# Altium schematic sheet LedMatrix_Top.SchDoc
size A4; Organization: Altium Limited; Address1: L3, 12a Rodborough Rd; Address2: Frenchs Forest; Address3: NSW; Address4: Australia 2086; DocumentNumber: 1; SheetNumber: 1; SheetTotal: 6
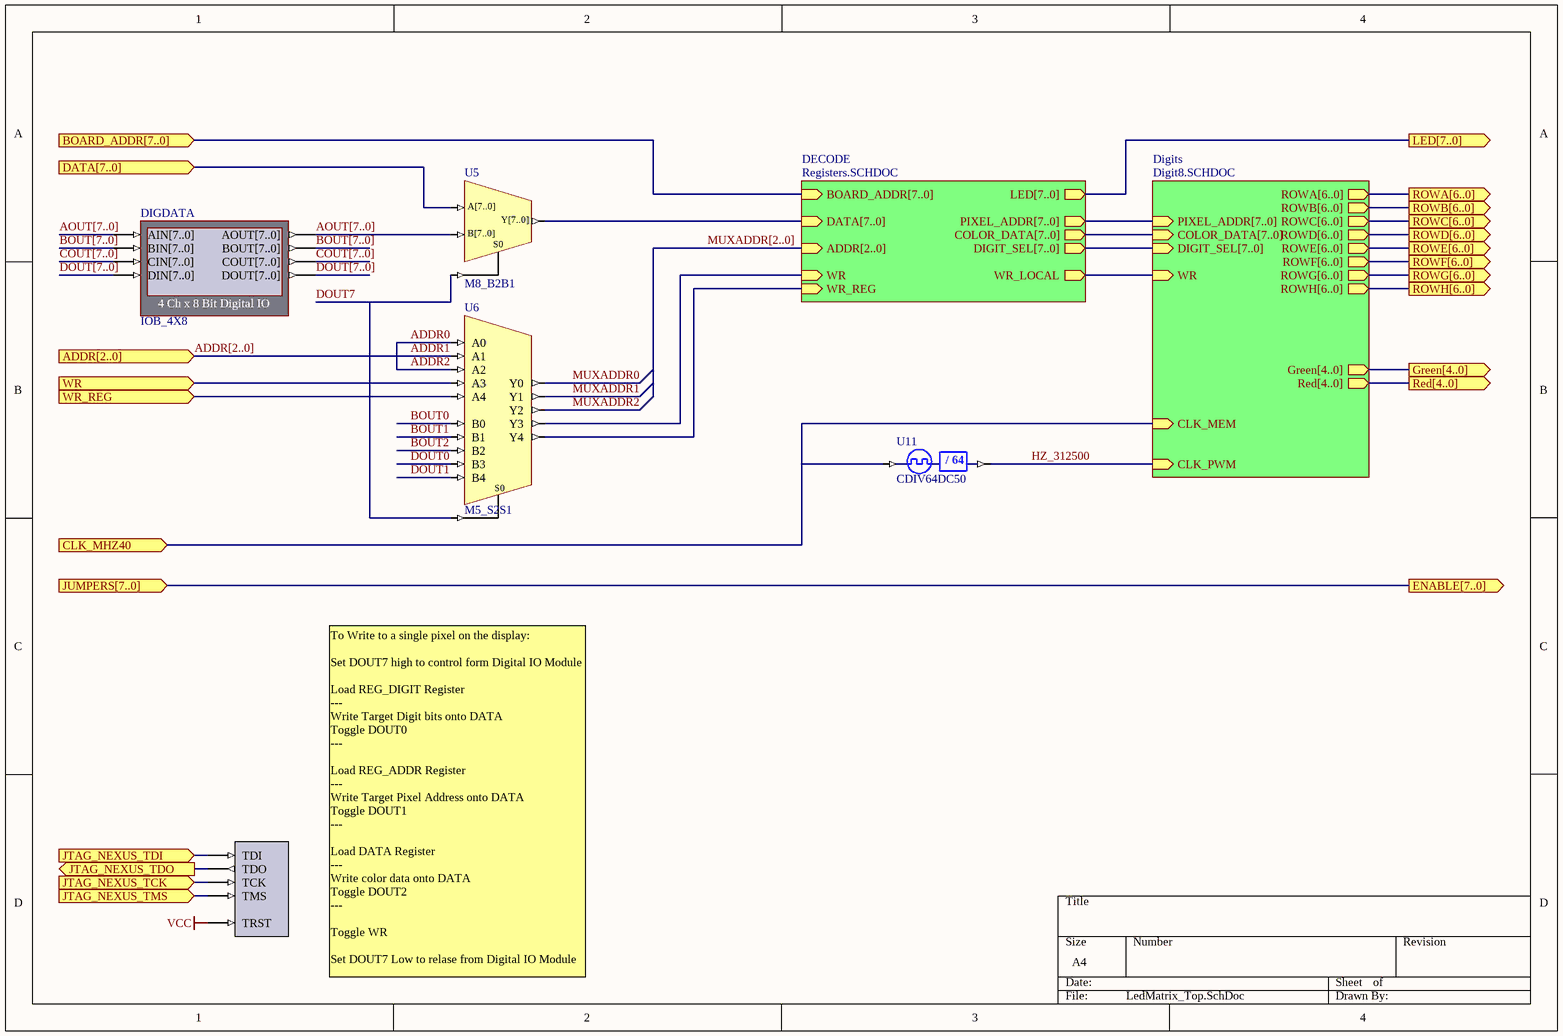
[diagram p0: LedMatrix_Top.SchDoc]

## Parts
DIGDATA  IOB_4X8
NEXUS_JTAG_PORT1  NEXUS_JTAG_PORT  (value not drawn)
U5  M8_B2B1
U6  M5_S2S1
U11  CDIV64DC50

## Sub-sheets
DECODE = Registers.SCHDOC: WR (in), ADDR[2..0] (in), BOARD_ADDR[7..0] (in), PIXEL_ADDR[7..0] (out), DATA[7..0] (in), COLOR_DATA[7..0] (out), DIGIT_SEL[7..0] (out), WR_LOCAL (out), LED[7..0] (out), WR_REG (in)
Digits = Digit8.SCHDOC: ROWB[6..0] (out), ROWC[6..0] (out), ROWD[6..0] (out), ROWF[6..0] (out), ROWG[6..0] (out), ROWH[6..0] (out), ROWE[6..0] (out), ROWA[6..0] (out), CLK_MEM (in), CLK_PWM (in), Red[4..0] (out), Green[4..0] (out), PIXEL_ADDR[7..0] (in), COLOR_DATA[7..0] (in), DIGIT_SEL[7..0] (in), WR (in)

## Ports
ADDR[2..0] (in), BOARD_ADDR[7..0] (in), CLK_MHZ40 (in), DATA[7..0] (in), ENABLE[7..0] (out), Green[4..0] (out), JTAG_NEXUS_TCK (in), JTAG_NEXUS_TDI (in), JTAG_NEXUS_TDO (out), JTAG_NEXUS_TMS (in), JUMPERS[7..0] (in), LED[7..0] (out), Red[4..0] (out), ROWA[6..0] (out), ROWB[6..0] (out), ROWC[6..0] (out), ROWD[6..0] (out), ROWE[6..0] (out), ROWF[6..0] (out), ROWG[6..0] (out), ROWH[6..0] (out), WR (in), WR_REG (in)

## Nets
VCC: NEXUS_JTAG_PORT1.TRST
ADDR0: U6.A0
ADDR1: U6.A1
ADDR2: U6.A2
AOUT[7..0]: DIGDATA.AIN[7..0] DIGDATA.AOUT[7..0] U5.B[7..0]
BOUT0: U6.B0
BOUT1: U6.B1
BOUT2: U6.B2
BOUT[7..0]: DIGDATA.BIN[7..0] DIGDATA.BOUT[7..0]
CLK_MHZ40: U11.CLKIN ; port CLK_MHZ40, sheet Digits/CLK_MEM
COUT[7..0]: DIGDATA.CIN[7..0] DIGDATA.COUT[7..0]
DATA[7..0]: U5.A[7..0] ; port DATA[7..0]
DOUT0: U6.B3
DOUT1: U6.B4
DOUT7: U5.S0 U6.S0
DOUT[7..0]: DIGDATA.DIN[7..0] DIGDATA.DOUT[7..0]
HZ_312500: U11.CLKDV ; sheet Digits/CLK_PWM
JTAG_NEXUS_TCK: NEXUS_JTAG_PORT1.TCK ; port JTAG_NEXUS_TCK
JTAG_NEXUS_TDI: NEXUS_JTAG_PORT1.TDI ; port JTAG_NEXUS_TDI
JTAG_NEXUS_TDO: NEXUS_JTAG_PORT1.TDO ; port JTAG_NEXUS_TDO
JTAG_NEXUS_TMS: NEXUS_JTAG_PORT1.TMS ; port JTAG_NEXUS_TMS
MUXADDR0: U6.Y0
MUXADDR1: U6.Y1
MUXADDR2: U6.Y2
WR: U6.A3 ; port WR
WR_REG: U6.A4 ; port WR_REG
NetU5_Y[7..0]: U5.Y[7..0] ; sheet DECODE/DATA[7..0]
NetU6_Y3: U6.Y3 ; sheet DECODE/WR
NetU6_Y4: U6.Y4 ; sheet DECODE/WR_REG
(unnamed): sheet Digits/WR, sheet DECODE/WR_LOCAL

## Buses and harness runs
bus ADDR[2..0] = port ADDR[2..0]
bus AOUT[7..0]
bus BOUT[7..0]
bus COUT[7..0]
bus DOUT[7..0]
bus MUXADDR[2..0] = sheet DECODE/ADDR[2..0]
bus port BOARD_ADDR[7..0] = sheet DECODE/BOARD_ADDR[7..0]
bus port ENABLE[7..0] = port JUMPERS[7..0]
bus port Green[4..0] = sheet Digits/Green[4..0]
bus port LED[7..0] = sheet DECODE/LED[7..0]
bus port Red[4..0] = sheet Digits/Red[4..0]
bus port ROWA[6..0] = sheet Digits/ROWA[6..0]
bus port ROWB[6..0] = sheet Digits/ROWB[6..0]
bus port ROWC[6..0] = sheet Digits/ROWC[6..0]
bus port ROWD[6..0] = sheet Digits/ROWD[6..0]
bus port ROWE[6..0] = sheet Digits/ROWE[6..0]
bus port ROWF[6..0] = sheet Digits/ROWF[6..0]
bus port ROWG[6..0] = sheet Digits/ROWG[6..0]
bus port ROWH[6..0] = sheet Digits/ROWH[6..0]
bus sheet DECODE/COLOR_DATA[7..0] = sheet Digits/COLOR_DATA[7..0]
bus sheet DECODE/DIGIT_SEL[7..0] = sheet Digits/DIGIT_SEL[7..0]
bus sheet DECODE/PIXEL_ADDR[7..0] = sheet Digits/PIXEL_ADDR[7..0]

## Notes on the sheet
- To Write to a single pixel on the display:
  Set DOUT7 high to control form Digital IO Module
  Load REG_DIGIT Register
  ---
  Write Target Digit bits onto DATA
  Toggle DOUT0
  ---
  Load REG_ADDR Register
  ---
  Write Target Pixel Address onto DATA
  Toggle DOUT1
  ---
  Load DATA Register
  ---
  Write color data onto DATA
  Toggle DOUT2
  ---
  Toggle WR
  Set DOUT7 Low to relase from Digital IO Module
- Title
- Size:
- Date:
- A4
- Number:
- Time:
- Revision:
- Sheet
- of
- File:
- (in symbol CDIV64DC50) / 64

## Library data of the parts
DIGDATA = IOB_4X8: 4 Ch x 8 Bit Digital IO; NEXUS_CORE: Instrument; NEXUS_JTAG_DEVICE: True; NEXUS_JTAG_ORDER: 0; Published: 30/09/2003; Publisher: Altium Hobart Technology Centre; Core Revision: 1.00.00
NEXUS_JTAG_PORT1 = NEXUS_JTAG_PORT: Nexus Processor JTAG Chain Connector; NEXUS_JTAG_CONNECTOR: True; Published: 5-Sep-2003; Publisher: Altium Hobart Technology Centre
U5 = M8_B2B1: 2x8-Bit Bus to 1x8-Bit Bus Multiplexer; ArchiveName: GENERIC; Published: 18-Nov-2003; Publisher: Altium Limited; Core Revision: 1.00.00
U6 = M5_S2S1: 2x5-Single Wire to 2x5-Single Wire Multiplexer; ArchiveName: GENERIC; VHDLIB_SIM: GENERIC_LIB; Published: 29-Jan-2004; Publisher: Altium Limited; Core Revision: 1.00.00
U11 = CDIV64DC50: Clock Divider by 64 with 50% Duty Cycle Output; ArchiveName: GENERIC; Published: 7-Nov-2003; Publisher: Altium Limited; Core Revision: 1.00.00